# Altium schematic sheet Programiralica.SchDoc
size A4
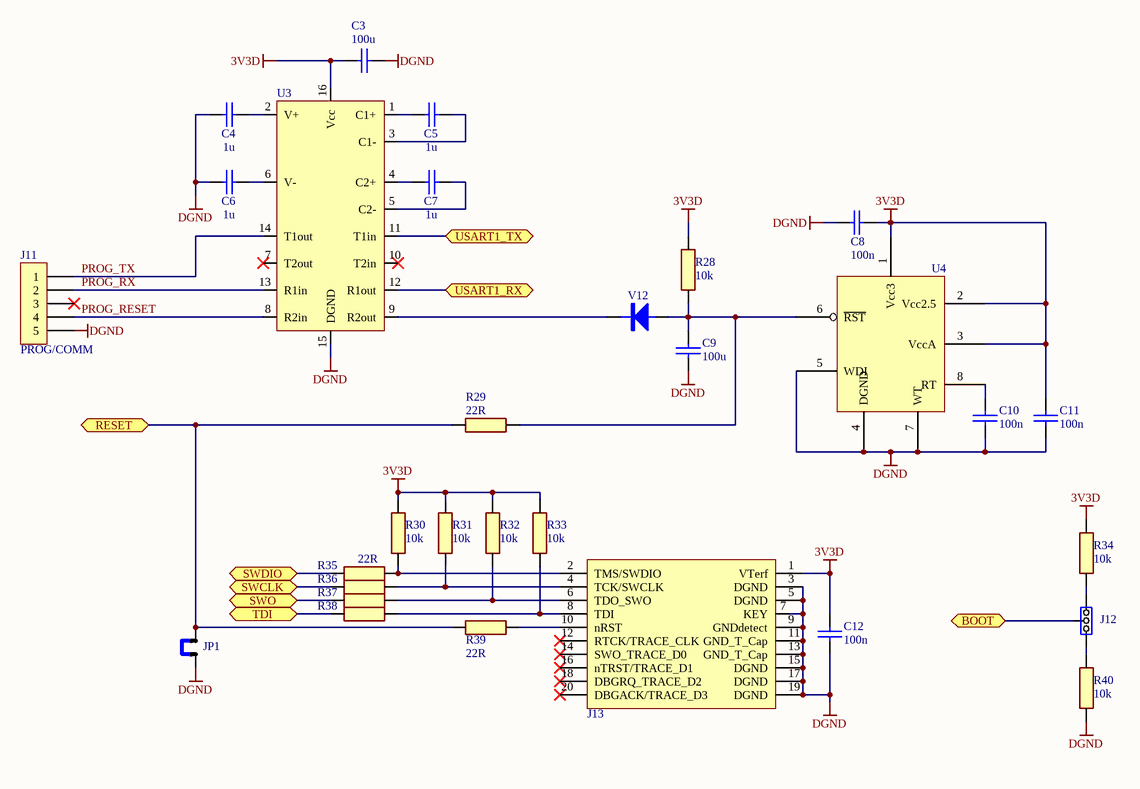
[diagram p0: Programiralica.SchDoc]

## Parts
C3  100u  [CAP_0805_SMD]
C4  1u  [CAP_0805_SMD]
C5  1u  [CAP_0805_SMD]
C6  1u  [CAP_0805_SMD]
C7  1u  [CAP_0805_SMD]
C8  100n  [CAP_0805_SMD]
C9  100u  [CAP_0805_SMD]
C10  100n  [CAP_0805_SMD]
C11  100n  [CAP_0805_SMD]
C12  100n  [CAP_0805_SMD]
J11  PROG/COMM  [CON-SIP-5]
J12  JUMPER_3_POLE  [JUMPER_3_POLE]  (value not drawn)
J13  JTAG-DEBUG-10x2  [JTAG-DEBUG-10x2-MOJ]  (value not drawn)
JP1  JUMPER  [KRATKO-LEMNI]  (value not drawn)
R28  10k  [RES_0805_SMD]
R29  22R  [RES_0805_SMD]
R30  10k  [RES_0805_SMD]
R31  10k  [RES_0805_SMD]
R32  10k  [RES_0805_SMD]
R33  10k  [RES_0805_SMD]
R34  10k  [RES_0805_SMD]
R35  22R  [RES_0805_SMD]
R36  22R  [RES_0805_SMD]  (value not drawn)
R37  22R  [RES_0805_SMD]  (value not drawn)
R38  22R  [RES_0805_SMD]  (value not drawn)
R39  22R  [RES_0805_SMD]
R40  10k  [RES_0805_SMD]
U3  MAX3232  [MAX3232]  (value not drawn)
U4  LTC1726  [LTC1726]  (value not drawn)
V12  DIODE  [SOD-323F]  (value not drawn)

## Ports
BOOT (bidir), RESET (bidir), SWCLK (bidir), SWDIO (bidir), SWO (bidir), TDI (bidir), USART1_RX (bidir), USART1_TX (bidir)

## Nets
3V3D: C3.1 C8.1 C11.2 C12.2 J13.1(VTerf) R28.2 R30.2 R31.2 R32.2 R33.2 R34.2 U3.16(Vcc) U4.1(Vcc3) U4.2(Vcc2.5) U4.3(VccA)
DGND: C3.2 C4.1 C6.1 C8.2 C9.1 C10.1 C11.1 C12.1 J11.5 J13.3(DGND) J13.5(DGND) J13.7(KEY) J13.9(GNDdetect) J13.11(GND_T_Cap) J13.13(GND_T_Cap) J13.15(DGND) J13.17(DGND) J13.19(DGND) JP1.1 R40.1 U3.15(DGND) U4.4(DGND) U4.5(WDI) U4.7(WT)
BOOT: J12.2 ; port BOOT
PROG_RESET: J11.4 U3.8(R2in)
PROG_RX: J11.2 U3.13(R1in)
PROG_TX: J11.1 U3.14(T1out)
RESET: JP1.2 R29.1 R39.1 ; port RESET
SWCLK: R36.1 ; port SWCLK
SWDIO: R35.1 ; port SWDIO
SWO: R37.1 ; port SWO
TDI: R38.1 ; port TDI
USART1_RX: U3.12(R1out) ; port USART1_RX
USART1_TX: U3.11(T1in) ; port USART1_TX
NetC4_2: C4.2 U3.2(V+)
NetC5_1: C5.1 U3.1(C1+)
NetC5_2: C5.2 U3.3(C1-)
NetC6_2: C6.2 U3.6(V-)
NetC7_1: C7.1 U3.4(C2+)
NetC7_2: C7.2 U3.5(C2-)
NetC9_2: C9.2 R28.1 R29.2 U4.6(~{RST}) V12.1
NetC10_2: C10.2 U4.8(RT)
NetJ12_1: J12.1 R40.2
NetJ12_3: J12.3 R34.1
NetJ13_2: J13.2(TMS/SWDIO) R30.1 R35.2
NetJ13_4: J13.4(TCK/SWCLK) R31.1 R36.2
NetJ13_6: J13.6(TDO_SWO) R32.1 R37.2
NetJ13_8: J13.8(TDI) R33.1 R38.2
NetJ13_10: J13.10(nRST) R39.2
NetU3_9: U3.9(R2out) V12.2

Not connected (* = marked no-connect by the designer): J11 3*; J13 12(RTCK/TRACE_CLK)* 14(SWO_TRACE_D0)* 16(nTRST/TRACE_D1)* 18(DBGRQ_TRACE_D2)* 20(DBGACK/TRACE_D3)*; U3 7(T2out)* 10(T2in)*

## Library data of the parts
C3-C12 = CAP: 0805
J11 = CON5: 5 Pin connector
J12 = JUMPER_3_POLE: 3 Pole jumper
J13 = CON-JTAG-10x2
R28-R40 = RES: 0805
U3 = MAX3232: RS232 chip
V12 = DIODE: SMD diode